# EAGLE design EMG - Module - Rev. B (EAGLE 9.6.2)

## Sheet 1 of 2
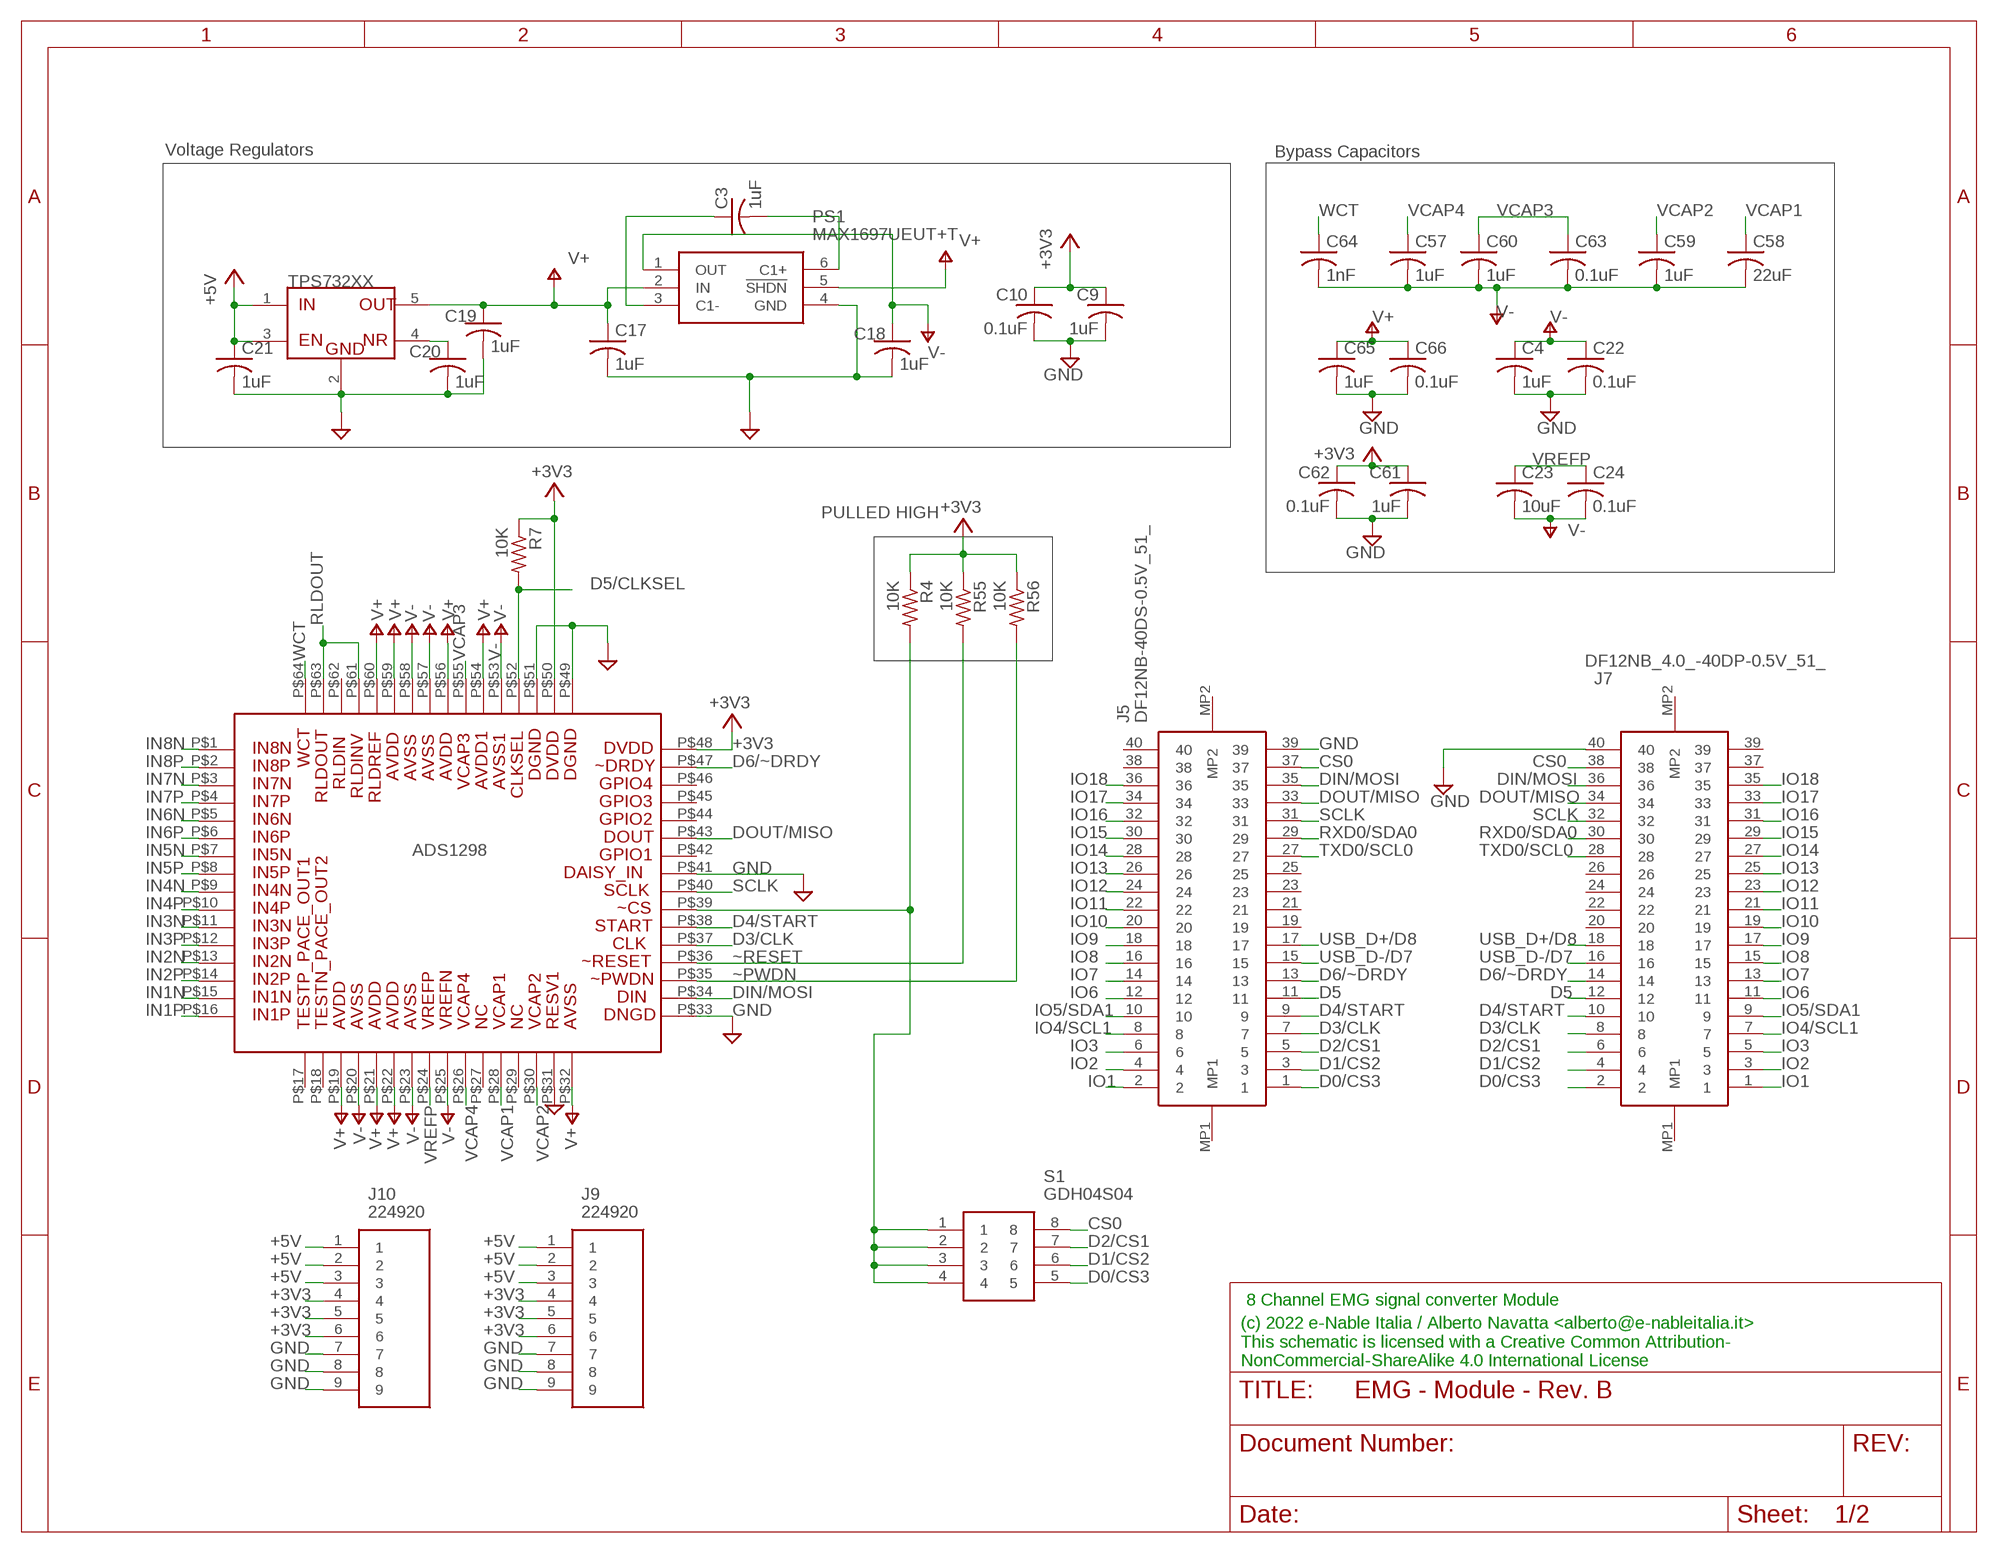
[diagram p0: schematic, sheet 1]

### Parts
C3  1uF  C-USC0402  [C0402]
C4  1uF  C-USC0402  [C0402]
C9  1uF  C-USC0402  [C0402]
C10  0.1uF  C-USC0402  [C0402]
C17  1uF  C-USC0402  [C0402]
C18  1uF  C-USC0402  [C0402]
C19  1uF  C-USC0402  [C0402]
C20  1uF  C-USC0402  [C0402]
C21  1uF  C-USC0402  [C0402]
C22  0.1uF  C-USC0402  [C0402]
C23  10uF  C-USC0402  [C0402]
C24  0.1uF  C-USC0402  [C0402]
C57  1uF  C-USC0402  [C0402]
C58  22uF  C-USC0402  [C0402]
C59  1uF  C-USC0402  [C0402]
C60  1uF  C-USC0402  [C0402]
C61  1uF  C-USC0402  [C0402]
C62  0.1uF  C-USC0402  [C0402]
C63  0.1uF  C-USC0402  [C0402]
C64  1nF  C-USC0402  [C0402]
C65  1uF  C-USC0402  [C0402]
C66  0.1uF  C-USC0402  [C0402]
J5  DF12NB-40DS-0.5V_51_  [DF12NB40DS05V51]
J7  DF12NB_4.0_-40DP-0.5V_51_  [DF12NB4040DP05V51]
J9  224920  [224920]
J10  224920  [224920]
PS1  MAX1697UEUT+T  [SOT95P280X145-6N]
R4  10K  R-US_R0402  [R0402]
R7  10K  R-US_R0402  [R0402]
R55  10K  R-US_R0402  [R0402]
R56  10K  R-US_R0402  [R0402]
S1  GDH04S04  [SOIC127P813X256-8N]
U1  U1  ADS1298  [TQFP-64]
U21  TPS732XX  [SOT23-5]

### Nets
+3V3: C9.1 C10.1 C61.1 C62.1 J9.4 J9.5 J9.6 J10.4 J10.5 J10.6 R4.1 R7.1 R55.1 R56.1 U1.P$48 U1.P$50
+5V: C21.1 J9.1 J9.2 J9.3 J10.1 J10.2 J10.3 U21.1(IN) U21.3(EN)
CS0: J5.37 J7.38 S1.8
D0/CS3: J5.1 J7.2 S1.5
D1/CS2: J5.3 J7.4 S1.6
D2/CS1: J5.5 J7.6 S1.7
D3/CLK: J5.7 J7.8 U1.P$37
D4/START: J5.9 J7.10 U1.P$38
D5: J5.11 J7.12
D5/CLKSEL: R7.2 U1.P$52
D6/~DRDY: J5.13 J7.14 U1.P$47
DIN/MOSI: J5.35 J7.36 U1.P$34
DOUT/MISO: J5.33 J7.34 U1.P$43
GND: C4.2 C9.2 C10.2 C17.2 C18.2 C19.2 C20.2 C21.2 C22.2 C61.2 C62.2 C65.2 C66.2 J5.39 J7.40 J9.7 J9.8 J9.9 J10.7 J10.8 J10.9 PS1.4(GND) U1.P$31 U1.P$33 U1.P$41 U1.P$49 U1.P$51 U21.2(GND) ; also sheet 2
IN1N: U1.P$15 ; also sheet 2
IN1P: U1.P$16 ; also sheet 2
IN2N: U1.P$13 ; also sheet 2
IN2P: U1.P$14 ; also sheet 2
IN3N: U1.P$11 ; also sheet 2
IN3P: U1.P$12 ; also sheet 2
IN4N: U1.P$9 ; also sheet 2
IN4P: U1.P$10 ; also sheet 2
IN5N: U1.P$7 ; also sheet 2
IN5P: U1.P$8 ; also sheet 2
IN6N: U1.P$5 ; also sheet 2
IN6P: U1.P$6 ; also sheet 2
IN7N: U1.P$3 ; also sheet 2
IN7P: U1.P$4 ; also sheet 2
IN8N: U1.P$1 ; also sheet 2
IN8P: U1.P$2 ; also sheet 2
IO1: J5.2 J7.1
IO2: J5.4 J7.3
IO3: J5.6 J7.5
IO4/SCL1: J5.8 J7.7
IO5/SDA1: J5.10 J7.9
IO6: J5.12 J7.11
IO7: J5.14 J7.13
IO8: J5.16 J7.15
IO9: J5.18 J7.17
IO10: J5.20 J7.19
IO11: J5.22 J7.21
IO12: J5.24 J7.23
IO13: J5.26 J7.25
IO14: J5.28 J7.27
IO15: J5.30 J7.29
IO16: J5.32 J7.31
IO17: J5.34 J7.33
IO18: J5.36 J7.35
N$17: C3.1 PS1.3(C1-)
N$18: C3.2 PS1.6(C1+)
N$20: C20.1 U21.4(NR)
RLDOUT: U1.P$61 U1.P$63 ; also sheet 2
RXD0/SDA0: J5.29 J7.30
SCLK: J5.31 J7.32 U1.P$40
TXD0/SCL0: J5.27 J7.28
USB_D+/D8: J5.17 J7.18
USB_D-/D7: J5.15 J7.16
V+: C17.1 C19.1 C65.1 C66.1 PS1.2(IN) PS1.5(!SHDN) U1.P$19 U1.P$21 U1.P$22 U1.P$32 U1.P$54 U1.P$56 U1.P$59 U1.P$60 U21.5(OUT)
V-: C4.1 C18.1 C22.1 C23.2 C24.2 C57.2 C58.2 C59.2 C60.2 C63.2 C64.2 PS1.1(OUT) U1.P$20 U1.P$23 U1.P$25 U1.P$53 U1.P$57 U1.P$58
VCAP1: C58.1 U1.P$28
VCAP2: C59.1 U1.P$30
VCAP3: C60.1 C63.1 U1.P$55
VCAP4: C57.1 U1.P$26
VREFP: C23.1 C24.1 U1.P$24
WCT: C64.1 U1.P$64
~CS: R4.2 S1.1 S1.2 S1.3 S1.4 U1.P$39
~PWDN: R56.2 U1.P$35
~RESET: R55.2 U1.P$36
Unconnected: J5.19 J5.21 J5.23 J5.25 J5.38 J5.40 J5.MP1 J5.MP2 J7.20 J7.22 J7.24 J7.26 J7.37 J7.39 J7.MP1 J7.MP2 U1.P$17 U1.P$18 U1.P$27 U1.P$29 U1.P$42 U1.P$44 U1.P$45 U1.P$46 U1.P$62

### Notes on the sheet
- Voltage Regulators | Bypass Capacitors
- PULLED HIGH
- 8 Channel EMG signal converter Module
- (c) 2022 e-Nable Italia / Alberto Navatta <alberto@e-nableitalia.it>
  This schematic is licensed with a Creative Common Attribution-
  NonCommercial-ShareAlike 4.0 International License

## Sheet 2 of 2
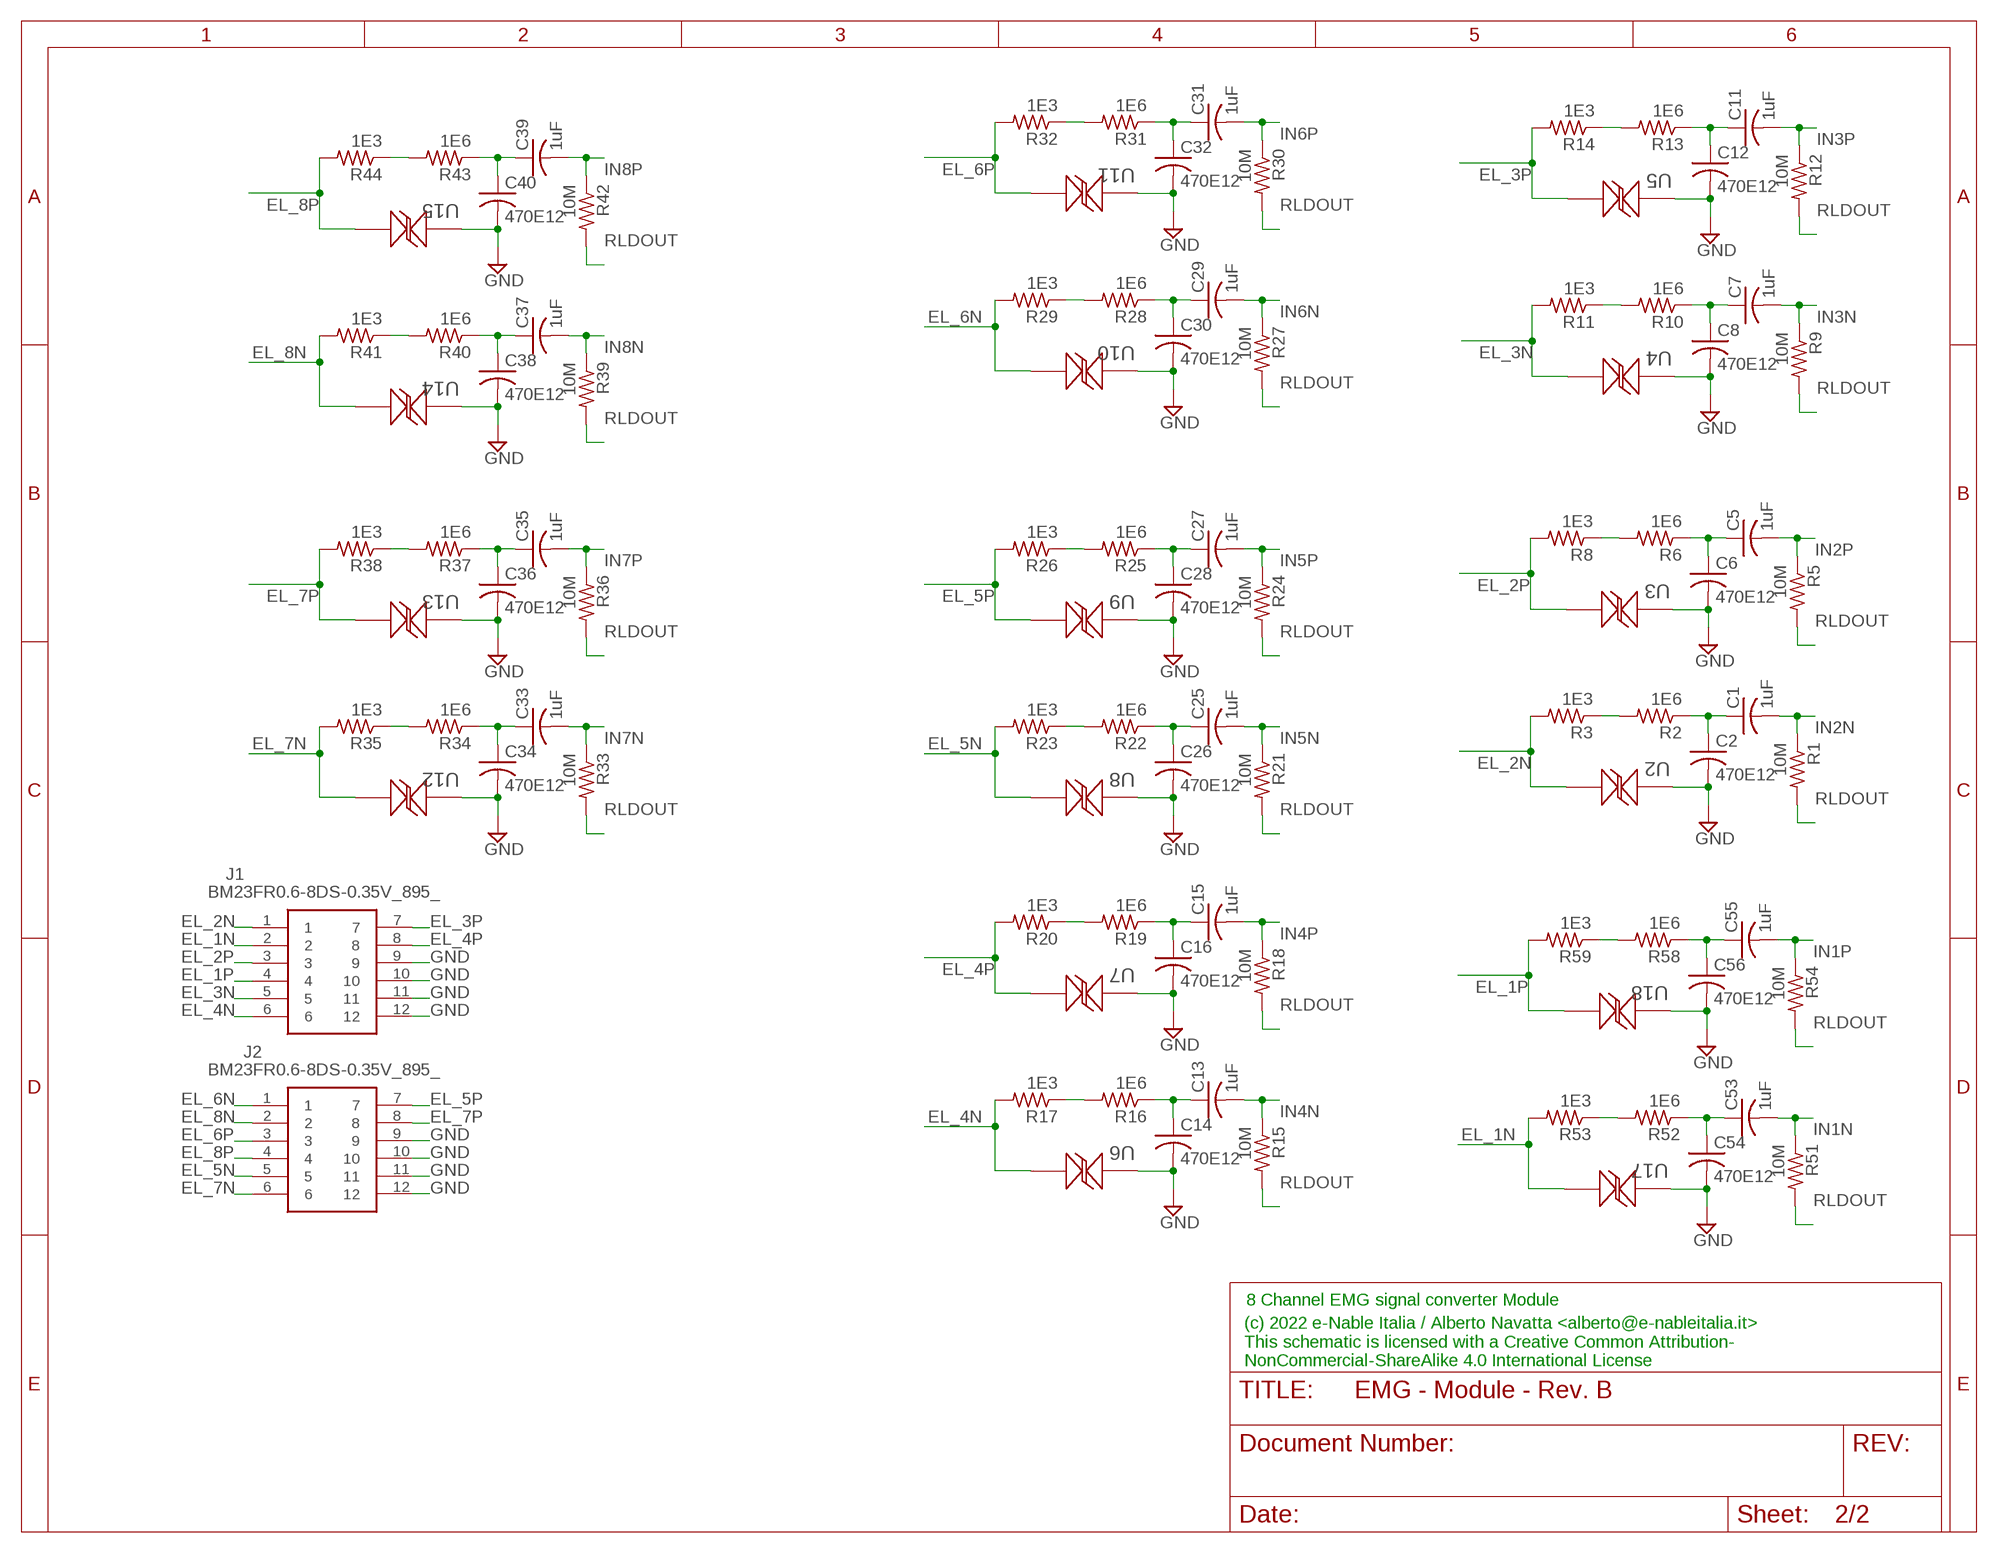
[diagram p1: schematic, sheet 2]

### Parts
C1  1uF  C-USC0402  [C0402]
C2  470E12  C-USC0402  [C0402]
C5  1uF  C-USC0402  [C0402]
C6  470E12  C-USC0402  [C0402]
C7  1uF  C-USC0402  [C0402]
C8  470E12  C-USC0402  [C0402]
C11  1uF  C-USC0402  [C0402]
C12  470E12  C-USC0402  [C0402]
C13  1uF  C-USC0402  [C0402]
C14  470E12  C-USC0402  [C0402]
C15  1uF  C-USC0402  [C0402]
C16  470E12  C-USC0402  [C0402]
C25  1uF  C-USC0402  [C0402]
C26  470E12  C-USC0402  [C0402]
C27  1uF  C-USC0402  [C0402]
C28  470E12  C-USC0402  [C0402]
C29  1uF  C-USC0402  [C0402]
C30  470E12  C-USC0402  [C0402]
C31  1uF  C-USC0402  [C0402]
C32  470E12  C-USC0402  [C0402]
C33  1uF  C-USC0402  [C0402]
C34  470E12  C-USC0402  [C0402]
C35  1uF  C-USC0402  [C0402]
C36  470E12  C-USC0402  [C0402]
C37  1uF  C-USC0402  [C0402]
C38  470E12  C-USC0402  [C0402]
C39  1uF  C-USC0402  [C0402]
C40  470E12  C-USC0402  [C0402]
C53  1uF  C-USC0402  [C0402]
C54  470E12  C-USC0402  [C0402]
C55  1uF  C-USC0402  [C0402]
C56  470E12  C-USC0402  [C0402]
J1  BM23FR0.6-8DS-0.35V_895_  [BM23FR068DS035V895]
J2  BM23FR0.6-8DS-0.35V_895_  [BM23FR068DS035V895]
R1  10M  R-US_R0402  [R0402]
R2  1E6  R-US_R0402  [R0402]
R3  1E3  R-US_R0402  [R0402]
R5  10M  R-US_R0402  [R0402]
R6  1E6  R-US_R0402  [R0402]
R8  1E3  R-US_R0402  [R0402]
R9  10M  R-US_R0402  [R0402]
R10  1E6  R-US_R0402  [R0402]
R11  1E3  R-US_R0402  [R0402]
R12  10M  R-US_R0402  [R0402]
R13  1E6  R-US_R0402  [R0402]
R14  1E3  R-US_R0402  [R0402]
R15  10M  R-US_R0402  [R0402]
R16  1E6  R-US_R0402  [R0402]
R17  1E3  R-US_R0402  [R0402]
R18  10M  R-US_R0402  [R0402]
R19  1E6  R-US_R0402  [R0402]
R20  1E3  R-US_R0402  [R0402]
R21  10M  R-US_R0402  [R0402]
R22  1E6  R-US_R0402  [R0402]
R23  1E3  R-US_R0402  [R0402]
R24  10M  R-US_R0402  [R0402]
R25  1E6  R-US_R0402  [R0402]
R26  1E3  R-US_R0402  [R0402]
R27  10M  R-US_R0402  [R0402]
R28  1E6  R-US_R0402  [R0402]
R29  1E3  R-US_R0402  [R0402]
R30  10M  R-US_R0402  [R0402]
R31  1E6  R-US_R0402  [R0402]
R32  1E3  R-US_R0402  [R0402]
R33  10M  R-US_R0402  [R0402]
R34  1E6  R-US_R0402  [R0402]
R35  1E3  R-US_R0402  [R0402]
R36  10M  R-US_R0402  [R0402]
R37  1E6  R-US_R0402  [R0402]
R38  1E3  R-US_R0402  [R0402]
R39  10M  R-US_R0402  [R0402]
R40  1E6  R-US_R0402  [R0402]
R41  1E3  R-US_R0402  [R0402]
R42  10M  R-US_R0402  [R0402]
R43  1E6  R-US_R0402  [R0402]
R44  1E3  R-US_R0402  [R0402]
R51  10M  R-US_R0402  [R0402]
R52  1E6  R-US_R0402  [R0402]
R53  1E3  R-US_R0402  [R0402]
R54  10M  R-US_R0402  [R0402]
R58  1E6  R-US_R0402  [R0402]
R59  1E3  R-US_R0402  [R0402]
U2  U2  ESD401DPYR  [DPY0002A]
U3  U3  ESD401DPYR  [DPY0002A]
U4  U4  ESD401DPYR  [DPY0002A]
U5  U5  ESD401DPYR  [DPY0002A]
U6  U6  ESD401DPYR  [DPY0002A]
U7  U7  ESD401DPYR  [DPY0002A]
U8  U8  ESD401DPYR  [DPY0002A]
U9  U9  ESD401DPYR  [DPY0002A]
U10  U10  ESD401DPYR  [DPY0002A]
U11  U18  ESD401DPYR  [DPY0002A]
U12  U12  ESD401DPYR  [DPY0002A]
U13  U13  ESD401DPYR  [DPY0002A]
U14  U14  ESD401DPYR  [DPY0002A]
U15  U15  ESD401DPYR  [DPY0002A]
U17  U17  ESD401DPYR  [DPY0002A]
U18  U18  ESD401DPYR  [DPY0002A]

### Nets
EL_1N: J1.2 R53.2 U17.2
EL_1P: J1.4 R59.2 U18.2
EL_2N: J1.1 R3.2 U2.2
EL_2P: J1.3 R8.2 U3.2
EL_3N: J1.5 R11.2 U4.2
EL_3P: J1.7 R14.2 U5.2
EL_4N: J1.6 R17.2 U6.2
EL_4P: J1.8 R20.2 U7.2
EL_5N: J2.5 R23.2 U8.2
EL_5P: J2.7 R26.2 U9.2
EL_6N: J2.1 R29.2 U10.2
EL_6P: J2.3 R32.2 U11.2
EL_7N: J2.6 R35.2 U12.2
EL_7P: J2.8 R38.2 U13.2
EL_8N: J2.2 R41.2 U14.2
EL_8P: J2.4 R44.2 U15.2
GND: C2.2 C6.2 C8.2 C12.2 C14.2 C16.2 C26.2 C28.2 C30.2 C32.2 C34.2 C36.2 C38.2 C40.2 C54.2 C56.2 J1.9 J1.10 J1.11 J1.12 J2.9 J2.10 J2.11 J2.12 U2.1 U3.1 U4.1 U5.1 U6.1 U7.1 U8.1 U9.1 U10.1 U11.1 U12.1 U13.1 U14.1 U15.1 U17.1 U18.1 ; also sheet 1
IN1N: C53.2 R51.1 ; also sheet 1
IN1P: C55.2 R54.1 ; also sheet 1
IN2N: C1.2 R1.1 ; also sheet 1
IN2P: C5.2 R5.1 ; also sheet 1
IN3N: C7.2 R9.1 ; also sheet 1
IN3P: C11.2 R12.1 ; also sheet 1
IN4N: C13.2 R15.1 ; also sheet 1
IN4P: C15.2 R18.1 ; also sheet 1
IN5N: C25.2 R21.1 ; also sheet 1
IN5P: C27.2 R24.1 ; also sheet 1
IN6N: C29.2 R27.1 ; also sheet 1
IN6P: C31.2 R30.1 ; also sheet 1
IN7N: C33.2 R33.1 ; also sheet 1
IN7P: C35.2 R36.1 ; also sheet 1
IN8N: C37.2 R39.1 ; also sheet 1
IN8P: C39.2 R42.1 ; also sheet 1
N$1: C1.1 C2.1 R2.1
N$2: R2.2 R3.1
N$3: C5.1 C6.1 R6.1
N$4: R6.2 R8.1
N$5: C7.1 C8.1 R10.1
N$6: R10.2 R11.1
N$7: C11.1 C12.1 R13.1
N$8: R13.2 R14.1
N$9: C13.1 C14.1 R16.1
N$10: R16.2 R17.1
N$11: C15.1 C16.1 R19.1
N$12: R19.2 R20.1
N$13: C25.1 C26.1 R22.1
N$14: R22.2 R23.1
N$15: C27.1 C28.1 R25.1
N$16: R25.2 R26.1
N$19: C29.1 C30.1 R28.1
N$21: R28.2 R29.1
N$22: C31.1 C32.1 R31.1
N$23: R31.2 R32.1
N$24: C33.1 C34.1 R34.1
N$25: R34.2 R35.1
N$26: C35.1 C36.1 R37.1
N$27: R37.2 R38.1
N$28: C37.1 C38.1 R40.1
N$29: R40.2 R41.1
N$30: C39.1 C40.1 R43.1
N$31: R43.2 R44.1
N$36: C53.1 C54.1 R52.1
N$37: R52.2 R53.1
N$38: C55.1 C56.1 R58.1
N$39: R58.2 R59.1
RLDOUT: R1.2 R5.2 R9.2 R12.2 R15.2 R18.2 R21.2 R24.2 R27.2 R30.2 R33.2 R36.2 R39.2 R42.2 R51.2 R54.2 ; also sheet 1

### Notes on the sheet
- 8 Channel EMG signal converter Module
- (c) 2022 e-Nable Italia / Alberto Navatta <alberto@e-nableitalia.it>
  This schematic is licensed with a Creative Common Attribution-
  NonCommercial-ShareAlike 4.0 International License

## Library data of the parts
C1 C2 C5-C8 C11-C16 C25-C40 C53-C56 = rcl:C-US: CAPACITOR, American symbol; SPICEPREFIX: C
C3 C4 C9 C10 C17-C24 C57-C66 = adafruit:C-US: CAPACITOR, American symbol
J1 J2 = SamacSys_Parts:BM23FR0.6-8DS-0.35V_895_: Board to Board & Mezzanine Connectors 8P RCPT STRGHT SMT SIGNAL ONLY Source: Datasheet <https://www.hirose.com/product/document?clcode=CL0480-0360-0-95&productname=BM23FR0.6-8DS-0.35V(895)&series=BM23FR&documenttype=2DDrawing&lang=en&documentid=D165611_en>; DESCRIPTION: Board to Board & Mezzanine Connectors 8P RCPT STRGHT SMT SIGNAL ONLY; HEIGHT: 0.6mm; MANUFACTURER_NAME: Hirose; MANUFACTURER_PART_NUMBER: BM23FR0.6-8DS-0.35V(895); MOUSER_PART_NUMBER: 798-23FR068DS035V895; MOUSER_PRICE-STOCK: https://www.mouser.co.uk/ProductDetail/Hirose-Connector/BM23FR0.6-8DS-0.35V895?qs=YCa%2FAAYMW02DW55bS3fRtQ%3D%3D
J5 = SamacSys_Parts:DF12NB-40DS-0.5V_51_: Board to Board & Mezzanine Connectors CONN RCPT 36POS SMD Source: Datasheet <https://www.hirose.com/en/product/document?clcode=CL0537-0290-0-51&productname=DF12NB-40DS-0.5V(51)&series=DF12N&documenttype=2DDrawing&lang=en&documentid=0001367362>; DESCRIPTION: Board to Board & Mezzanine Connectors CONN RCPT 36POS SMD; HEIGHT: 2.9mm; MANUFACTURER_NAME: Hirose; MANUFACTURER_PART_NUMBER: DF12NB-40DS-0.5V(51); MOUSER_PART_NUMBER: 798-DF12NB40DS0551; MOUSER_PRICE-STOCK: https://www.mouser.co.uk/ProductDetail/Hirose-Connector/DF12NB-40DS-0.5V51?qs=DPoM0jnrROV9WbEBnogTmg%3D%3D
J7 = SamacSys_Parts:DF12NB_4.0_-40DP-0.5V_51_: Board to!! Board !! & Mezzanine Connectors CONN HDR 40POS SMD G Source: Datasheet <https://www.hirose.com/en/product/document?clcode=CL0537-0596-0-51&productname=DF12NB(4.0)-40DP-0.5V(51)&series=DF12N&documenttype=2DDrawing&lang=en&documentid=0001367371>; DESCRIPTION: Board to!! Board !! & Mezzanine Connectors CONN HDR 40POS SMD G; HEIGHT: 3.5mm; MANUFACTURER_NAME: Hirose; MANUFACTURER_PART_NUMBER: DF12NB(4.0)-40DP-0.5V(51); MOUSER_PART_NUMBER: 798-DF12NB4040DP0551; MOUSER_PRICE-STOCK: https://www.mouser.co.uk/ProductDetail/Hirose-Connector/DF12NB4.0-40DP-0.5V51?qs=DPoM0jnrROUKZpllIjGjYw%3D%3D
J9 J10 = SamacSys_Parts:224920: Board to Board & Mezzanine Connectors 9P 0.8MM VERT FML CLASS 4 3MM SMT Source: Datasheet; DESCRIPTION: Board to Board & Mezzanine Connectors 9P 0.8MM VERT FML CLASS 4 3MM SMT; HEIGHT: 3.96mm; MANUFACTURER_NAME: ERNI; MANUFACTURER_PART_NUMBER: 224920; MOUSER_PART_NUMBER: 305-224920; MOUSER_PRICE-STOCK: https://www.mouser.co.uk/ProductDetail/ERNI/224920?qs=Kh9WxvXxjWmfiTh6L%2FvUxg%3D%3D
PS1 = SamacSys_Parts:MAX1697UEUT+T: MAXIM INTEGRATED PRODUCTS - MAX1697UEUT+T - CHARGE PUMP, INVERTING, SOT-23-6 Source: Datasheet <https://componentsearchengine.com/Datasheets/2/MAX1697UEUT T.pdf>; DESCRIPTION: MAXIM INTEGRATED PRODUCTS - MAX1697UEUT+T - CHARGE PUMP, INVERTING, SOT-23-6; HEIGHT: 1.45mm; MANUFACTURER_NAME: Maxim Integrated; MANUFACTURER_PART_NUMBER: MAX1697UEUT+T; MOUSER_PART_NUMBER: 700-MAX1697UEUT+T; MOUSER_PRICE-STOCK: https://www.mouser.co.uk/ProductDetail/Maxim-Integrated/MAX1697UEUT%2bT?qs=tN2KIZ2dHC5YEnQi4QVGng%3D%3D
R1-R3 R5 R6 R8-R44 R51-R54 R58 R59 = rcl:R-US_: RESISTOR, American symbol; SPICEPREFIX: R
R4 R7 R55 R56 = adafruit:R-US_: RESISTOR, American symbol
S1 = SamacSys_Parts:GDH04S04: 4way half pitch surface mount DIL switch 4 Way Surface Mount DIP Switch 4P Source: Datasheet <http://www.te.com/commerce/DocumentDelivery/DDEController?Action=showdoc&DocId=Customer Drawing1571983C6pdfEnglishENG_CD_1571983_C6.pdf1571983-4>; DESCRIPTION: 4way half pitch surface mount DIL switch 4 Way Surface Mount DIP Switch 4P; HEIGHT: 2.56mm; MANUFACTURER_NAME: TE Connectivity; MANUFACTURER_PART_NUMBER: GDH04S04; MOUSER_PART_NUMBER: 506-GDH04S04; MOUSER_PRICE-STOCK: https://www.mouser.co.uk/ProductDetail/TE-Connectivity-Alcoswitch/GDH04S04?qs=wg6chLqwgwrFTPnUQOwjIg%3D%3D
U1 = ADS1298:ADS1298: ADS1298 Chris Yim - May 2015
U2-U15 U17 U18 = ESD401:ESD401DPYR; COPYRIGHT: Copyright (C) 2022 Ultra Librarian. All rights reserved.; MANUFACTURER_PART_NUMBER: ESD401DPYR; MFR_NAME: Texas Instruments; REFDES: RefDes; TYPE: TYPE
U21 = sot23-5:TPS732XX

## Module ELECTRODE
Ports: 

### Library data of the parts

## Net classes
2 Power: width 0.203 mm

## Board
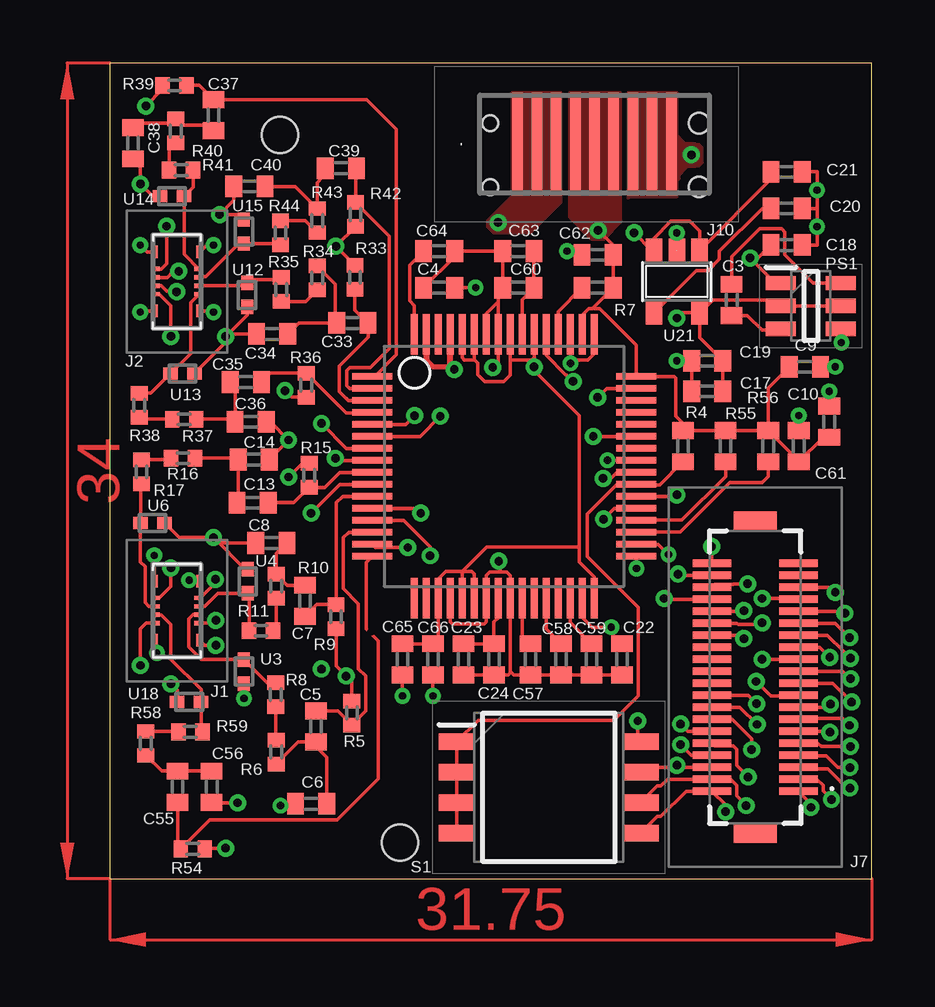
[diagram p2: board, top side]
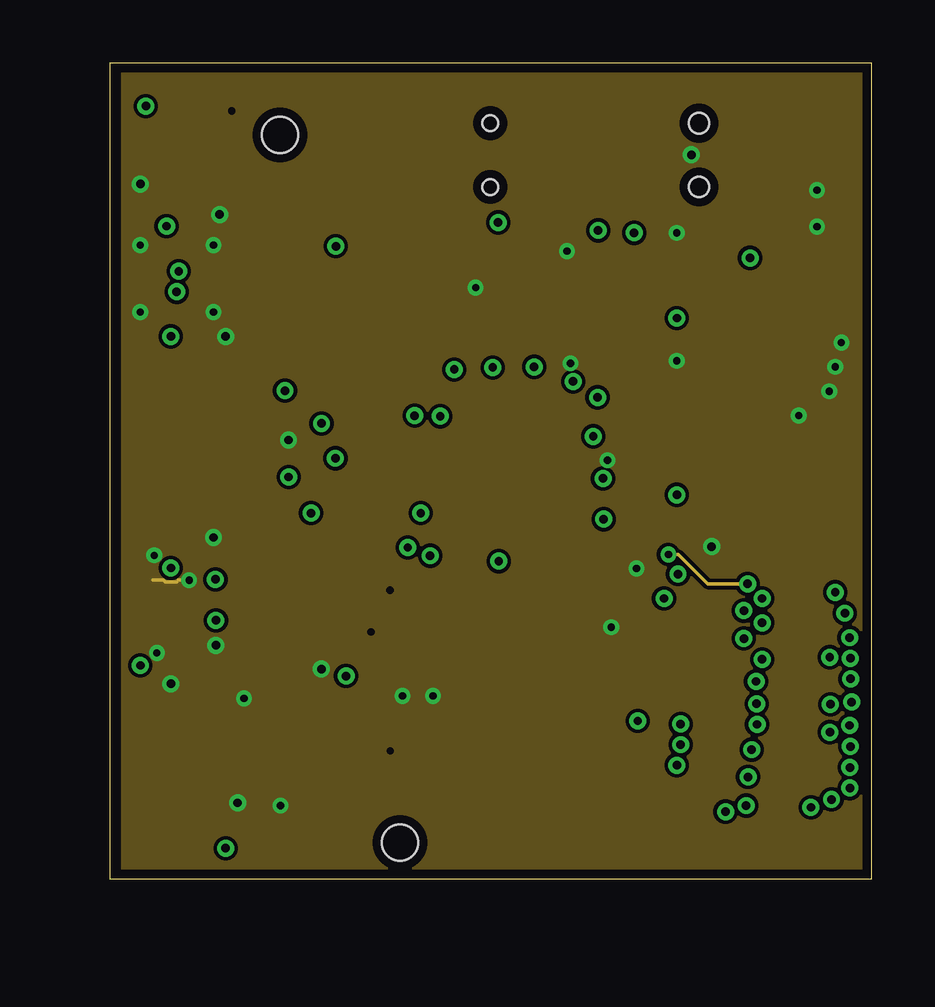
[diagram p3: board, inner layer Route2]
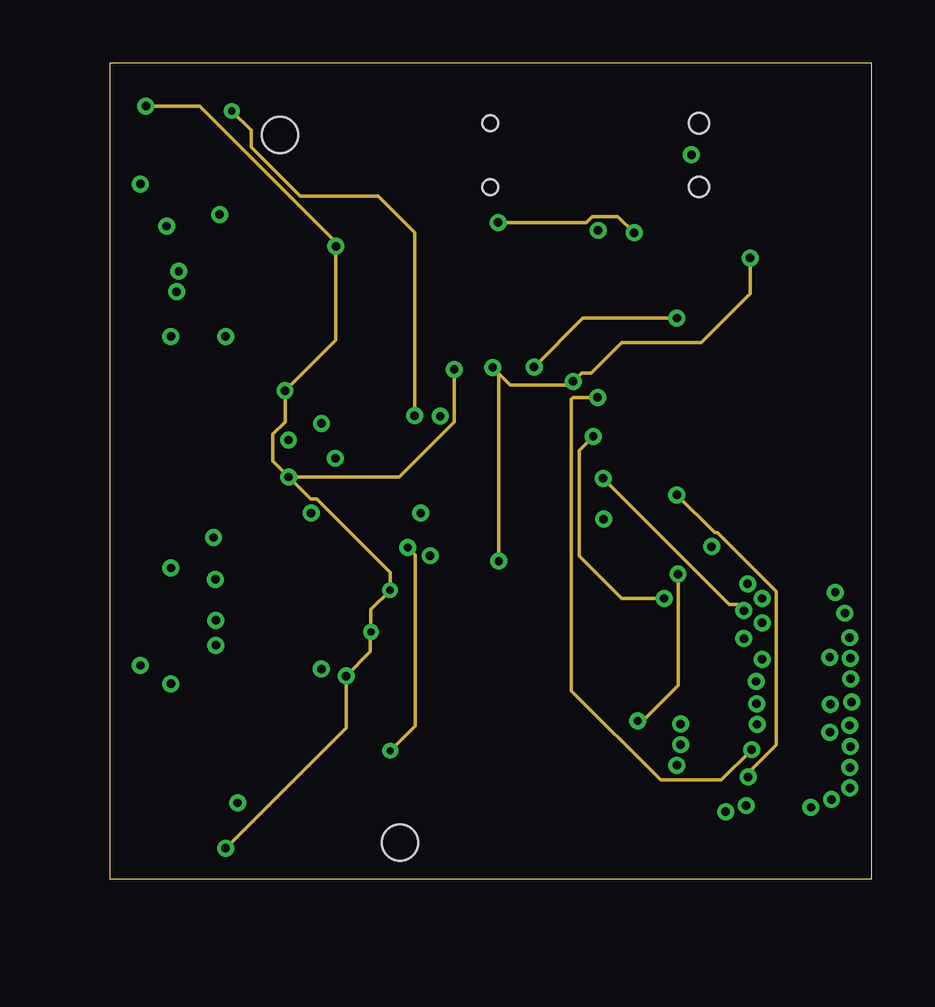
[diagram p4: board, inner layer Route15]
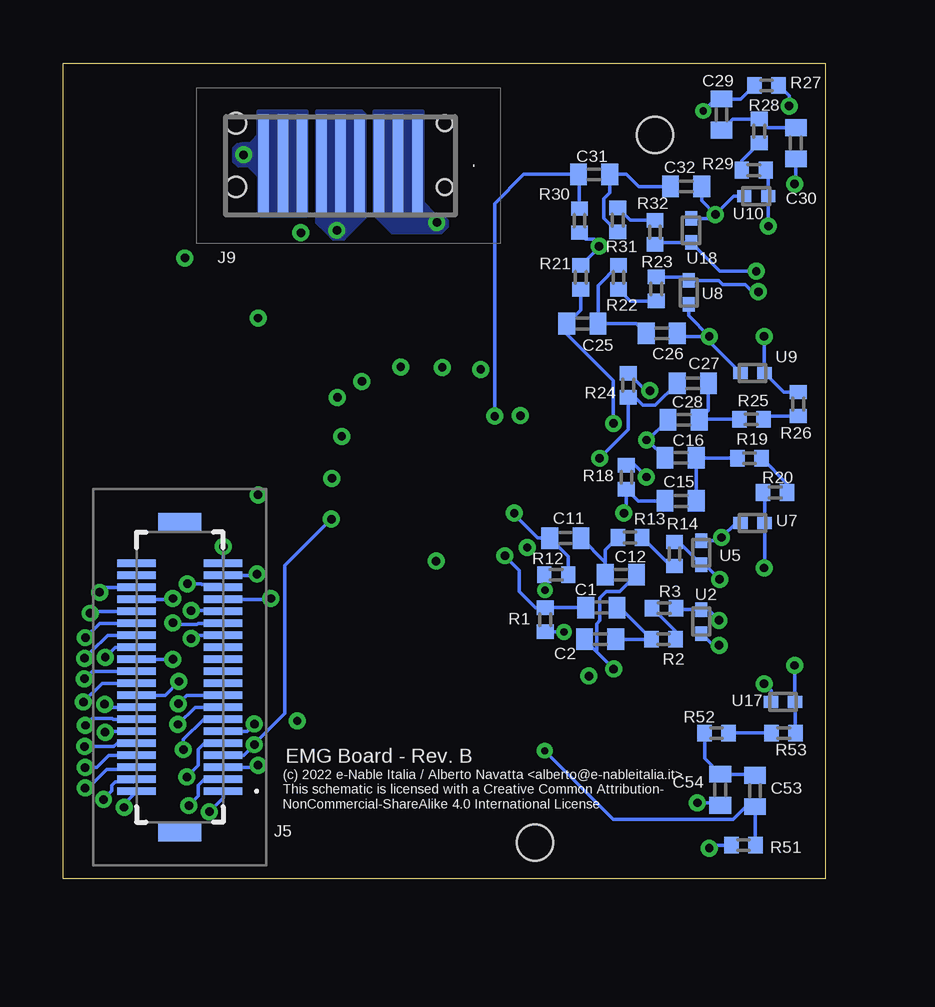
[diagram p5: board, bottom side, seen from below]

Size 31.75 x 34 mm. Coordinates in mm from the lower left corner, seen from the top.
Outline: 0,0 31.75,0 31.75,34 0,34 0,0
Copper layers ([2:1+(2*15)+16:15]): Top 0.0356mm / dielectric 1.5011mm / Route2 0.0356mm / dielectric 0.1499mm / Route15 0.0356mm / dielectric 0.2007mm / Bottom 0.0356mm
Design rules "LaenPCBOrder *": minimum track width 6mil, minimum drill 0.35mm, track to track 6mil, track to pad 6mil, pad to pad 6mil, via to via 6mil, smd to smd 6mil, copper to edge 15mil, drill to drill 6mil, minimum pad ring 7mil, minimum via ring 7mil, stop-mask expansion 3mil, vias tented up to drill 14mil, thermal gap 10mil
Holes 1.5 mm at 12.09,1.5 7.09,31

### Footprints (pad centres in the part's own frame; a part is rotated, then mirrored left to right if it is on the bottom)
C0402 = smd 0.7 x 0.9: 1 -0.65,0; 2 0.65,0
BM23FR068DS035V895 = smd 0.18 x 0.38: 1 -0.525,-0.91; 2 -0.525,0.91; 3 -0.175,-0.91; 4 -0.175,0.91; 5 0.175,-0.91; 6 0.175,0.91; 7 0.525,-0.91; 8 0.525,0.91 | smd 0.52 x 0.3: 9 -1.23,-0.95; 10 -1.23,0.95; 11 1.23,-0.95; 12 1.23,0.95
DF12NB40DS05V51 = smd 0.3 x 1.6: 1 -4.75,-1.8; 2 -4.75,1.8; 3 -4.25,-1.8; 4 -4.25,1.8; 5 -3.75,-1.8; 6 -3.75,1.8; 7 -3.25,-1.8; 8 -3.25,1.8; 9 -2.75,-1.8; 10 -2.75,1.8; 11 -2.25,-1.8; 12 -2.25,1.8; 13 -1.75,-1.8; 14 -1.75,1.8; 15 -1.25,-1.8; 16 -1.25,1.8; 17 -0.75,-1.8; 18 -0.75,1.8; 19 -0.25,-1.8; 20 -0.25,1.8; 21 0.25,-1.8; 22 0.25,1.8; 23 0.75,-1.8; 24 0.75,1.8; 25 1.25,-1.8; 26 1.25,1.8; 27 1.75,-1.8; 28 1.75,1.8; 29 2.25,-1.8; 30 2.25,1.8; 31 2.75,-1.8; 32 2.75,1.8; 33 3.25,-1.8; 34 3.25,1.8; 35 3.75,-1.8; 36 3.75,1.8; 37 4.25,-1.8; 38 4.25,1.8; 39 4.75,-1.8; 40 4.75,1.8 | smd 0.8 x 1.8: MP1 -6.45,0; MP2 6.45,0
DF12NB4040DP05V51 = smd 0.3 x 1.6: 1 -4.75,-1.8; 2 -4.75,1.8; 3 -4.25,-1.8; 4 -4.25,1.8; 5 -3.75,-1.8; 6 -3.75,1.8; 7 -3.25,-1.8; 8 -3.25,1.8; 9 -2.75,-1.8; 10 -2.75,1.8; 11 -2.25,-1.8; 12 -2.25,1.8; 13 -1.75,-1.8; 14 -1.75,1.8; 15 -1.25,-1.8; 16 -1.25,1.8; 17 -0.75,-1.8; 18 -0.75,1.8; 19 -0.25,-1.8; 20 -0.25,1.8; 21 0.25,-1.8; 22 0.25,1.8; 23 0.75,-1.8; 24 0.75,1.8; 25 1.25,-1.8; 26 1.25,1.8; 27 1.75,-1.8; 28 1.75,1.8; 29 2.25,-1.8; 30 2.25,1.8; 31 2.75,-1.8; 32 2.75,1.8; 33 3.25,-1.8; 34 3.25,1.8; 35 3.75,-1.8; 36 3.75,1.8; 37 4.25,-1.8; 38 4.25,1.8; 39 4.75,-1.8; 40 4.75,1.8 | smd 0.8 x 1.8: MP1 -6.5,0; MP2 6.5,0
224920 = smd 0.44 x 4.3: 1 -3.2,0; 2 -2.4,0; 3 -1.6,0; 4 -0.8,0; 5 0,0; 6 0.8,0; 7 1.6,0; 8 2.4,0; 9 3.2,0 | hole 0.65: -4.35,0.88 | hole 0.85: 4.35,0.88
SOT95P280X145-6N = smd 1.25 x 0.6: 1 -1.25,0.95; 2 -1.25,0; 3 -1.25,-0.95; 4 1.25,-0.95; 5 1.25,0; 6 1.25,0.95
R0402 = smd 0.6 x 0.7: 1 -0.5,0; 2 0.5,0
R0402' = smd 0.7 x 0.9: 1 -0.65,0; 2 0.65,0
SOIC127P813X256-8N = smd 1.475 x 0.7: 1 -3.838,1.905; 2 -3.838,0.635; 3 -3.838,-0.635; 4 -3.838,-1.905; 5 3.838,-1.905; 6 3.838,-0.635; 7 3.838,0.635; 8 3.838,1.905
TQFP-64 = smd 1.676 x 0.279: P$1 -5.58,3.67; P$2 -5.58,3.17; P$3 -5.58,2.67; P$4 -5.58,2.17; P$5 -5.58,1.67; P$6 -5.58,1.17; P$7 -5.58,0.67; P$8 -5.58,0.17; P$9 -5.58,-0.33; P$10 -5.58,-0.83; P$11 -5.58,-1.33; P$12 -5.58,-1.83; P$13 -5.58,-2.33; P$14 -5.58,-2.83; P$15 -5.58,-3.33; P$16 -5.58,-3.83; P$33 5.42,-3.83; P$34 5.42,-3.33; P$35 5.42,-2.83; P$36 5.42,-2.33; P$37 5.42,-1.83; P$38 5.42,-1.33; P$39 5.42,-0.83; P$40 5.42,-0.33; P$41 5.42,0.17; P$42 5.42,0.67; P$43 5.42,1.17; P$44 5.42,1.67; P$45 5.42,2.17; P$46 5.42,2.67; P$47 5.42,3.17; P$48 5.42,3.67 | smd 0.279 x 1.676: P$17 -3.83,-5.58; P$18 -3.33,-5.58; P$19 -2.83,-5.58; P$20 -2.33,-5.58; P$21 -1.83,-5.58; P$22 -1.33,-5.58; P$23 -0.83,-5.58; P$24 -0.33,-5.58; P$25 0.17,-5.58; P$26 0.67,-5.58; P$27 1.17,-5.58; P$28 1.67,-5.58; P$29 2.17,-5.58; P$30 2.67,-5.58; P$31 3.17,-5.58; P$32 3.67,-5.58; P$49 3.67,5.42; P$50 3.17,5.42; P$51 2.67,5.42; P$52 2.17,5.42; P$53 1.67,5.42; P$54 1.17,5.42; P$55 0.67,5.42; P$56 0.17,5.42; P$57 -0.33,5.42; P$58 -0.83,5.42; P$59 -1.33,5.42; P$60 -1.83,5.42; P$61 -2.33,5.42; P$62 -2.83,5.42; P$63 -3.33,5.42; P$64 -3.83,5.42
DPY0002A = smd 0.6 x 0.5: 1 -0.5,0; 2 0.5,0
SOT23-5 = smd 0.69 x 0.99: 1 -0.95,-1.29; 2 0,-1.29; 3 0.95,-1.29; 4 0.95,1.3; 5 -0.95,1.3

### Placement (x,y rotation side)
C1  9.32,11.3 180 bottom
C2  9.37,9.98 180 bottom
C3  25.91,24.13 90 top
C4  13.72,24.64 0 top
C5  8.59,6.35 90 top
C6  8.38,3.12 180 top
C7  8.13,11.58 270 top
C8  6.73,14 180 top
C9  28.96,21.34 0 top
C10  29.97,19.05 90 top
C11  10.82,14.2 180 bottom
C12  8.51,12.67 0 bottom
C13  5.94,15.67 0 top
C14  5.99,17.48 0 top
C15  6.02,15.75 180 bottom
C16  6.02,17.55 180 bottom
C17  24.89,20.32 180 top
C18  28.19,26.42 0 top
C19  24.89,21.59 180 top
C20  28.19,27.94 0 top
C21  28.19,29.46 0 top
C22  21.34,9.14 90 top
C23  14.73,9.14 270 top
C24  16,9.14 270 top
C25  10.11,23.14 180 bottom
C26  6.81,22.73 0 bottom
C27  5.51,20.65 180 bottom
C28  5.89,19.13 180 bottom
C29  4.32,31.85 90 bottom
C30  1.22,30.66 270 bottom
C31  9.63,29.36 180 bottom
C32  5.79,28.85 0 bottom
C33  10.11,23.16 0 top
C34  6.76,22.71 180 top
C35  5.66,20.7 0 top
C36  5.87,19.05 0 top
C37  4.32,31.83 90 top
C38  0.97,30.66 270 top
C39  9.63,29.62 0 top
C40  5.82,28.85 180 top
C53  2.92,3.66 270 bottom
C54  4.37,3.71 270 bottom
C55  2.82,3.84 270 top
C56  4.24,3.84 270 top
C57  17.53,9.14 270 top
C58  18.8,9.14 270 top
C59  20.07,9.14 270 top
C60  17.02,24.64 180 top
C61  28.7,18.03 90 top
C62  20.32,26.01 180 top
C63  17.02,26.16 180 top
C64  13.72,26.16 0 top
C65  12.19,9.14 270 top
C66  13.46,9.14 270 top
J1  2.79,11.18 90 top
J2  2.79,24.89 270 top
J5  26.89,8.4 90 bottom
J7  26.89,8.4 90 top
J9  20.19,29.72 180 bottom
J10  20.19,30.62 0 top
PS1  29.21,23.88 0 top
R1  11.66,10.79 270 bottom
R2  6.73,9.98 0 bottom
R3  6.71,11.28 0 bottom
R4  10K  [R0402']  23.88,18.03 270 top
R5  10.08,6.91 90 top
R6  6.93,5.28 90 top
R7  10K  [R0402']  20.32,24.64 180 top
R8  6.91,7.67 90 top
R9  9.42,10.92 270 top
R10  6.93,12.19 270 top
R11  6.3,10.34 180 top
R12  11.2,12.67 180 bottom
R13  8.13,14.22 0 bottom
R14  6.27,13.54 90 bottom
R15  8.31,16.81 90 top
R16  3.05,17.53 180 top
R17  1.32,16.97 270 top
R18  8.28,16.74 90 bottom
R19  3.15,17.53 0 bottom
R20  2.08,16.1 180 bottom
R21  10.19,25.07 90 bottom
R22  8.61,25.07 270 bottom
R23  7.04,24.59 90 bottom
R24  8.2,20.57 90 bottom
R25  3.07,19.15 0 bottom
R26  1.12,19.79 90 bottom
R27  2.44,33.07 0 bottom
R28  2.74,31.17 270 bottom
R29  2.97,29.54 0 bottom
R30  10.24,27.43 270 bottom
R31  8.64,27.46 90 bottom
R32  7.09,26.95 270 bottom
R33  10.21,25.07 90 top
R34  8.64,25.04 270 top
R35  7.14,24.56 90 top
R36  8.18,20.57 270 top
R37  3.1,19.15 180 top
R38  1.22,19.74 90 top
R39  2.69,33.07 180 top
R40  2.74,31.17 270 top
R41  2.97,29.54 0 top
R42  10.24,27.69 270 top
R43  8.64,27.43 270 top
R44  7.11,26.92 270 top
R51  3.4,1.4 180 bottom
R52  4.52,6.07 0 bottom
R53  1.73,6.07 0 bottom
R54  3.45,1.24 0 top
R55  10K  [R0402']  25.65,18.03 270 top
R56  10K  [R0402']  27.43,18.03 270 top
R58  1.5,5.64 90 top
R59  3.35,6.12 0 top
S1  18.29,3.81 0 top
U1  16.51,17.27 0 top
U2  5.16,10.72 90 bottom
U3  5.59,8.64 90 top
U4  5.74,12.4 270 top
U5  5.16,13.59 270 bottom
U6  1.78,14.83 180 top
U7  3.02,14.83 0 bottom
U8  5.69,24.43 90 bottom
U9  3.02,21.08 0 bottom
U10  2.87,28.45 0 bottom
U11  5.59,27.03 270 bottom
U12  5.71,24.33 90 top
U13  3.02,21.06 180 top
U14  2.59,28.45 0 top
U15  5.59,26.97 270 top
U17  1.75,7.37 0 bottom
U18  3.3,7.37 0 top
U21  23.62,24.89 180 top

### Tracks (layer width: path | path; a pad name or v marks a point on that pad's centre or on a via)
+3V3  (via drill 0.35)
  Top 0.152: 20.14,23.8 20.09,23.76 19.95,23.76 19.68,23.49 U1.P$50 | 20.14,23.8 R7.1 | 20.14,23.8 20.18,23.76 20.41,23.76 21.93,22.24 U1.P$48 23.52,20.94 23.58,20.88 23.58,19.29 23.88,19 R4.1 R55.1 R56.1 | R56.1 28.7,17.41 C61.1 29.72,18.4 C10.1 | R56.1 27.43,20.46 C9.1 | R7.1 20.97,24.78 | v20.34,27.03 20.97,26.4 C62.1 21.08,26.01 20.97,25.9 R7.1
  Route2 0.152: 20.37,27 v20.34,27.03
  pour Bottom (no thermals): 19.3,32 21.18,32 21.18,27.36 20.75,26.92 20.5,26.67 20.32,26.67 20.07,26.67 19.96,26.77 19.18,27.56 19.18,27.64 19.18,31.88
  pour Top (no thermals): 19.15,32.77 21.26,32.77 21.26,27.46 21.31,27.41 20.57,26.67 20.07,26.67 19.15,27.58
+5V  (via drill 0.35)
  Top 0.152: C21.1 27.54,29.15 U21.1 24.57,26.99 24.16,27.41 23.37,27.41 22.67,26.71 U21.3 22.59,26.18 v21.84,26.92
  Route15 0.152: v16.18,27.36 19.85,27.36 20.11,27.61 21.16,27.61 v21.84,26.92
  pour Bottom (no thermals): 16.26,27.69 16,27.69 15.75,27.43 15.75,27.18 16,26.92 18.03,26.92 18.8,27.69 18.8,32 16.76,32 16.76,28.19
  pour Top (no thermals): 16.76,32.77 18.8,32.77 18.8,28.19 17.53,26.92 16,26.92 15.75,27.18 15.75,27.43 16.76,28.45
CS0  (via drill 0.35)
  Top 0.152: v23.67,12.7 23.72,12.65 J5.37 | S1.8 22,5.84 v22,6.58
  Route15 0.152: v22,6.58 22.2,6.58 23.67,8.05 v23.67,12.7
  Bottom 0.152: J5.37 23.72,12.65 v23.67,12.7
D0/CS3  (via drill 0.35)
  Top 0.152: S1.5 22.82,2.6 22.96,2.6 24.01,3.65 J5.1 25.65,3.08 v25.65,2.79
  Bottom 0.152: v25.65,2.79 25.09,3.36 J5.1
D1/CS2  (via drill 0.35)
  Top 0.152: S1.6 22.82,3.87 22.96,3.87 23.24,4.15 J5.3 25.86,4.15 26.12,3.9 26.12,3.44 v26.51,3.05
  Bottom 0.152: v26.51,3.05 26.12,3.44 26.12,3.9 25.86,4.15 J5.3
D2/CS1  (via drill 0.35)
  Top 0.152: S1.7 22.33,4.65 23.62,4.65 | 23.62,4.65 J5.5 | 23.62,4.65 v23.62,4.73
  Bottom 0.152: v23.62,4.73 23.7,4.65 J5.5
D3/CLK  (via drill 0.35)
  Top 0.152: v23.78,5.59 24.22,5.15 J5.7 | U1.P$37 21.02,15.44 v20.57,14.99
  Bottom 0.152: J5.7 24.22,5.15 v23.78,5.59 23.78,5.62 22.51,6.9 22.51,13.05 v20.57,14.99
D4/START  (via drill 0.35)
  Top 0.152: J5.9 25.21,5.53 25.98,5.53 26.12,5.39 26.12,4.72 v26.59,4.24 | v23.62,16 23.56,15.94 U1.P$38
  Route15 0.152: v23.62,16 25.2,14.42 25.31,14.42 27.76,11.98 27.76,5.58 26.59,4.41 v26.59,4.24
  Bottom 0.152: v26.59,4.24 26.12,4.72 26.12,5.39 25.86,5.65 J5.9
D5  (via drill 0.35)
  Top 0.152: v23.78,6.45 24.08,6.15 J5.11
  Bottom 0.152: J5.11 24.08,6.15 v23.78,6.45
D5/CLKSEL
  Top 0.152: U1.P$52 18.68,23.65 R7.2
D6/~DRDY  (via drill 0.35)
  Top 0.152: v26.74,5.38 26.74,5.84 25.93,6.65 J5.13 | v20.32,20.07 20.7,20.44 U1.P$47
  Route15 0.152: v26.74,5.38 25.47,4.11 22.95,4.11 19.23,7.83 19.23,19.99 19.3,20.07 v20.32,20.07
  Bottom 0.152: v26.74,5.38 26.74,5.81 25.9,6.65 J5.13
DIN/MOSI  (via drill 0.3 layers 1-2, 0.35)
  Top 0.152: J5.35 25.21,12.27 25.98,12.27 26,12.29 v26.57,12.29 | U1.P$34 22.85,13.94 v23.27,13.51
  Route2 0.152: v23.27,13.51 23.68,13.51 24.9,12.29 v26.57,12.29
  Bottom 0.152: J5.35 25.21,12.27 25.98,12.27 26,12.29 v26.57,12.29
DOUT/MISO  (via drill 0.35)
  Top 0.152: J5.33 23.12,11.65 v23.09,11.68 | v20.14,18.44 U1.P$43
  Route15 0.152: v23.09,11.68 21.34,11.68 19.56,13.46 19.56,17.86 v20.14,18.44
  Bottom 0.152: J5.33 23.12,11.65 v23.09,11.68
EL_1N  (via drill 0.35)
  Top 0.152: J1.2 1.51,10.65 1.27,10.41 v1.27,8.89
  Bottom 0.152: v1.27,8.89 1.27,7.38 U17.2 1.25,6.1 R53.2
EL_1P
  Top 0.152: R59.2 3.8,6.17 U18.2 3.8,7.88 2.54,9.14 2.54,10.6 2.14,10.99 J1.4
EL_2N  (via drill 0.35)
  Top 0.152: J1.1 4.31,10.66 v4.42,10.77
  Bottom 0.152: R3.2 6.21,11.22 U2.2 4.87,11.22 v4.42,10.77
EL_2P
  Top 0.152: R8.2 6.55,8.17 U3.2 3.82,9.14 3.81,9.14 3.81,9.15 3.29,9.67 3.29,10.84 3.47,11.02 3.69,11.02 J1.3
EL_3N
  Top 0.152: J1.5 3.96,11.36 4.5,11.89 U4.2 5.8,11.84 R11.2
EL_3P  (via drill 0.35)
  Top 0.152: J1.7 3.77,11.7 4.4,12.33 v4.4,12.48
  Bottom 0.152: v4.4,12.48 5.01,13.09 U5.2 6.11,14.04 R14.2
EL_4N
  Top 0.152: J1.6 1.62,11.36 1.46,11.52 1.46,13.01 1.27,13.21 U6.2 1.28,16.42 R17.2
EL_4P  (via drill 0.35)
  Top 0.152: J1.8 2.05,11.7 2.54,12.19 v2.54,12.95
  Bottom 0.152: v2.54,12.95 2.52,12.97 U7.2 2.52,16.04 R20.2
EL_5N  (via drill 0.35)
  Top 0.152: J2.5 2.15,24.72 2.37,24.49 2.76,24.49 v2.78,24.47
  Bottom 0.152: v2.78,24.47 3.04,24.47 3.34,24.77 4.26,24.77 4.43,24.93 U8.2 5.84,25.09 R23.2
EL_5P  (via drill 0.35)
  Top 0.152: J2.7 2.06,24.37 2.54,23.89 v2.54,22.61
  Bottom 0.152: v2.54,22.61 2.54,21.1 U9.2 1.73,20.29 R26.2
EL_6N  (via drill 0.35)
  Top 0.152: J2.1 2.14,25.42 2.36,25.64 v2.36,27.2
  Bottom 0.152: 2.47,29.32 2.47,29.46 | 2.47,29.46 R29.2 | v2.36,27.2 U10.2 2.37,29.36 2.47,29.46
EL_6P  (via drill 0.35)
  Top 0.152: J2.3 2.39,25.07 2.65,25.32 v2.87,25.32
  Bottom 0.152: v2.87,25.32 4.39,25.32 U11.2 7.01,26.53 R32.2
EL_7N
  Top 0.152: 6.91,24.83 7.04,24.96 | 7.04,24.96 R35.2 | J2.6 5.6,24.72 U12.2 5.85,24.96 7.04,24.96
EL_7P
  Top 0.152: J2.8 3.7,24.36 3.37,24.02 3.37,21.9 U13.2 1.7,20.24 R38.2
EL_8N
  Top 0.152: 3.35,29.41 R41.2 3.47,28.83 U14.2 3.09,26.03 J2.2
EL_8P
  Top 0.152: J2.4 3.74,25.1 3.99,25.1 5.37,26.48 U15.2 7.06,26.48 R44.2
GND  (via drill 0.3 layers 1-2, 0.35)
  Top 0.152: 19.66,11.67 U1.P$31 19.68,10.89 20.09,10.48 v20.89,10.48 20.93,10.48 20.93,10.2 C22.2 | 19.34,21.62 19.91,21.62 20.18,21.89 U1.P$49 | C17.2 C19.2 v23.62,21.59 | U1.P$51 19.18,21.78 19.34,21.62 | C4.2 v15.24,24.64 | 19.34,21.62 v19.2,21.48 | U1.P$41 v20.74,17.44 | 29.72,19.7 C10.2 v29.97,20.32 | C61.2 v28.7,19.3 | C9.2 v30.23,21.34 | C21.2 29.46,29.46 v29.46,28.7 29.46,27.94 | 29.46,27.94 C20.2 | C18.2 29.46,26.42 v29.46,27.18 29.46,27.94 | C62.2 19.2,26.01 v19.05,26.16 | J10.7 21.84,30.57 | J10.8 22.61,30.61 | U21.2 v23.62,26.92 | U1.P$33 21.93,12.94 v21.95,12.93 | J5.39 25.09,13.82 v25.07,13.84 | C66.2 v13.46,7.62 | C65.2 v12.19,7.62 | 3.74,26.35 J2.10 4.04,26.42 v4.32,26.42 | C6.2 7.66,3.05 v7.11,3.05 | J1.10 1.84,9.53 v1.96,9.41 | U3.1 v5.59,7.52 | 5.8,13.72 C8.2 4.55,13.99 v4.32,14.22 | C36.2 6.68,19.05 v7.44,18.29 7.44,18.27 C14.2 | U12.1 5.71,23.5 v4.83,22.61 | C34.2 4.93,22.71 v4.83,22.61 | U13.1 4.83,22.36 v4.83,22.61 | U15.1 5.38,27.69 v4.57,27.69 5.17,28.28 C40.2 | J2.9 1.56,26.12 v1.27,26.42 | J2.11 1.31,23.66 v1.27,23.62 | J2.12 4.28,23.66 v4.32,23.62 | U14.1 1.78,28.45 v1.27,28.96 1.27,29.7 C38.2 | U6.1 2.89,14.22 v4.32,14.22 | U4.1 5.65,12.89 v4.32,14.22 | v2.54,8.13 2.8,7.87 U18.1 | J1.11 3.34,12.41 v3.3,12.45 | J1.12 v1.84,13.47 v1.85,13.48 | J1.9 3.96,9.73 v4.42,9.73 | v5.32,3.16 4.27,3.16 C56.2 | PS1.4 30.48,22.91 v30.48,22.35
  Route2 0.152: v3.3,12.45 2.85,12.45 2.78,12.37 2.3,12.37 2.23,12.45 1.78,12.45
  Bottom 0.152: J5.39 25.07,13.17 v25.07,13.84 | C16.2 7.41,18.29 v7.44,18.29 7.38,18.29 C28.2 | C26.2 6.03,22.61 v4.83,22.61 | U8.1 5.69,23.47 v4.83,22.61 | U9.1 4.83,22.39 v4.83,22.61 | U11.1 4.73,27.53 v4.57,27.69 | U10.1 3.81,28.45 v4.57,27.69 | C32.2 5.14,28.25 v4.57,27.69 | C30.2 1.22,29.01 v1.27,28.96 | U7.1 3.71,14.83 v4.32,14.22 4.45,14.09 U5.1 | 9.53,9.45 v8.81,8.74 | C12.2 8.55,11.98 9.12,11.98 9.39,11.71 9.39,10.76 9.53,10.63 9.53,9.45 | U17.1 2.25,7.84 v2.54,8.13 | 9.53,9.45 10.02,9.95 C2.2 | v4.42,9.73 4.67,9.73 U2.1 | C54.2 4.47,3.16 v5.32,3.16
  other vias: 24.23,30.18
  pour Route2 (no thermals): 0.53,33.78 31.75,33.78 31.75,0.25 0.53,0.25
  pour Bottom (no thermals): 21.59,32 23.62,32 23.62,30.99 23.88,30.73 23.98,30.63 24.1,30.63 24.46,30.63 24.64,30.45 24.64,29.9 24.46,29.72 24.03,29.72 23.6,29.29 23.6,28.42 23.6,27.66 23.55,27.61 21.59,27.61
  pour Top (no thermals): 21.59,32.77 23.62,32.77 23.62,30.99 23.88,30.73 23.98,30.63 24.51,30.63 24.59,30.56 24.66,30.48 24.66,30.38 24.66,29.84 24.64,29.82 24.51,29.69 24.41,29.69 24.05,29.69 24,29.64 23.7,29.34 23.7,29.18 23.62,29.11 23.62,28.42 21.64,28.42 21.59,28.37
IN1N  (via drill 0.3 layers 15-16, 0.35)
  Top 0.152: U1.P$15 11.06,13.81 11.86,13.81 11.87,13.81 v12.41,13.81
  Route15 0.152: v12.41,13.81 12.71,13.5 12.71,6.37 v11.68,5.33
  Bottom 0.152: 3.05,3.01 3.3,3.01 3.82,2.48 8.83,2.48 v11.68,5.33 | 3.05,3.01 C53.2 | R51.1 2.9,2.86 3.05,3.01
IN1P
  Top 0.152: 10.95,13.46 U1.P$16 10.68,13.19 10.68,10.41 11.18,9.91 11.18,4.15 9.48,2.45 4.16,2.45 R54.1 2.82,1.38 C55.2
IN2N  (via drill 0.35)
  Top 0.152: U1.P$13 12.24,14.94 13.34,13.84 v13.34,13.46
  Bottom 0.152: C1.2 11.65,11.3 R1.1 12.06,11.29 12.74,11.98 12.74,12.86 v13.34,13.46
IN2P
  Top 0.152: 8.59,7.25 C5.2 9.49,7 R5.1 10.66,6.99 10.66,8.45 10.36,8.75 10.36,11.46 9.73,12.09 9.73,14.22 9.95,14.44 U1.P$14
IN3N
  Top 0.152: C7.2 8.62,11.42 R9.1 9.42,15.67 9.69,15.94 U1.P$11
IN3P  (via drill 0.35)
  Top 0.152: 10.91,15.42 U1.P$12 12.75,15.44 v12.95,15.24
  Bottom 0.152: R12.1 10.7,13.43 C11.2 11.98,14.2 12.95,15.17 v12.95,15.24
IN4N
  Top 0.152: C13.2 7.66,15.67 R15.1 8.95,16.32 9.58,16.94 U1.P$9
IN4P  (via drill 0.35)
  Top 0.152: v8.38,15.24 9.58,16.44 U1.P$10
  Bottom 0.152: C15.2 7.79,15.75 R18.1 8.28,15.34 v8.38,15.24
IN5N  (via drill 0.35)
  Top 0.152: v8.82,18.98 9.86,17.94 U1.P$7
  Bottom 0.152: R21.1 10.19,23.71 C25.2 10.76,22.7 8.82,20.76 v8.82,18.98
IN5P  (via drill 0.35)
  Top 0.152: U1.P$8 9.48,17.44 v9.4,17.53
  Bottom 0.152: v9.4,17.53 8.2,18.72 R24.1 | R24.1 | R24.1 7.92,20.07 7.59,19.74 7.07,19.74 C27.2
IN6N  (via drill 0.3 layers 15-16, 0.35)
  Top 0.152: U1.P$5 12.34,18.94 v12.7,19.3
  Route15 0.152: v5.08,32 5.88,31.2 5.88,30.5 7.93,28.45 11.18,28.45 12.7,26.92 v12.7,19.3
  Bottom 0.152: R27.1 3.51,32.5 C29.2 4.58,32.5 v5.08,32
IN6P  (via drill 0.35)
  Top 0.152: v13.77,19.28 12.93,18.44 U1.P$6
  Bottom 0.152: v13.77,19.28 13.77,28.14 12.55,29.36 10.41,29.36 | C31.2 10.41,29.36 | R30.1 10.24,29.18 10.41,29.36
IN7N
  Top 0.152: R33.1 10.21,23.71 C33.2 10.76,22.58 9.56,21.38 9.56,20.31 9.86,20.02 | 9.86,20.02 | 9.86,20.02 9.93,19.94 U1.P$3
IN7P
  Top 0.152: 8.04,21.21 R36.1 | U1.P$4 10.89,19.41 9.85,19.41 R36.1 | C35.2 6.69,21.07 R36.1
IN8N
  Top 0.152: R39.1 3.72,33.07 C37.2 10.7,32.48 11.94,31.24 11.94,21.84 11.04,20.94 U1.P$1
IN8P
  Top 0.152: C39.2 10.24,29.58 R42.1 11.63,26.79 11.63,22.1 10.85,21.31 10,21.31 9.86,21.18 9.86,20.57 9.99,20.44 U1.P$2
IO1  (via drill 0.35)
  Top 0.152: J5.2 29.21,3.13 v29.21,2.97
  Bottom 0.152: J5.2 29.21,3.13 v29.21,2.97
IO2  (via drill 0.35)
  Top 0.152: v30.07,3.3 29.72,3.65 29.72,3.9 29.46,4.15 J5.4
  Bottom 0.152: J5.4 28.81,4.03 29.58,4.03 29.72,3.9 29.72,3.65 v30.07,3.3
IO3  (via drill 0.35)
  Top 0.152: J5.6 28.76,4.57 29.91,4.57 30.7,3.78 v30.83,3.78
  Bottom 0.152: J5.6 28.79,4.55 29.94,4.55 30.7,3.78 v30.83,3.78
IO4/SCL1  (via drill 0.35)
  Top 0.152: v30.84,4.64 30.33,4.64 29.85,5.12 28.72,5.12 J5.8
  Bottom 0.152: J5.8 29.84,5.15 30.35,4.64 v30.84,4.64
IO5/SDA1  (via drill 0.35)
  Top 0.152: J5.10 29.5,5.65 29.64,5.51 v30.86,5.51
  Bottom 0.152: J5.10 29.5,5.65 29.64,5.51 v30.86,5.51
IO6  (via drill 0.35)
  Top 0.152: v30,6.11 29.95,6.15 J5.12
  Bottom 0.152: J5.12 29.95,6.15 v30,6.11
IO7  (via drill 0.35)
  Top 0.152: J5.14 28.71,6.67 29.69,6.67 29.71,6.69 30.53,6.69 v30.82,6.39
  Bottom 0.152: J5.14 29.67,6.65 29.71,6.69 30.53,6.69 v30.82,6.39
IO8  (via drill 0.35)
  Top 0.152: v30.02,7.27 29.9,7.15 J5.16
  Bottom 0.152: J5.16 29.9,7.15 v30.02,7.27
IO9  (via drill 0.35)
  Top 0.152: v26.92,8.22 27.53,7.62 28.66,7.62 J5.18
  Bottom 0.152: J5.18 27.5,7.65 v26.92,8.22
IO10  (via drill 0.35)
  Top 0.152: v30.91,7.37 30.12,8.15 J5.20
  Bottom 0.152: J5.20 30.12,8.15 v30.91,7.37
IO11  (via drill 0.35)
  Top 0.152: v30.86,8.33 30.54,8.65 J5.22
  Bottom 0.152: J5.22 30.54,8.65 v30.86,8.33
IO12  (via drill 0.35)
  Top 0.152: J5.24 v27.18,9.15 v27.18,9.14
  Bottom 0.152: J5.24 v27.18,9.14
IO13  (via drill 0.35)
  Top 0.152: v29.99,9.23 29.57,9.65 J5.26
  Bottom 0.152: J5.26 29.57,9.65 v29.99,9.23
IO14  (via drill 0.35)
  Top 0.152: v30.85,9.19 30.57,9.47 29.9,10.15 J5.28
  Bottom 0.152: v30.85,9.19 30.57,9.47 29.9,10.15 J5.28
IO15  (via drill 0.35)
  Top 0.152: v30.82,10.05 30.22,10.65 J5.30
  Bottom 0.152: J5.30 30.22,10.65 v30.82,10.05
IO16  (via drill 0.35)
  Top 0.152: J5.32 30.54,11.15 v30.62,11.07
  Bottom 0.152: J5.32 30.54,11.15 v30.62,11.07
IO17  (via drill 0.35)
  Top 0.152: v27.18,11.68 28.65,11.68 J5.34
  Bottom 0.152: J5.34 27.21,11.65 v27.18,11.68
IO18  (via drill 0.35)
  Top 0.152: J5.36 30.01,12.15 v30.23,11.94
  Bottom 0.152: J5.36 30.01,12.15 v30.23,11.94
N$1
  Bottom 0.152: C1.1 8.55,11.3 R2.1 C2.1
N$2
  Bottom 0.152: R2.2 6.23,10.3 R3.1
N$3
  Top 0.152: R6.1 7.85,5.7 8.38,5.7 | 8.38,5.7 C5.1 | C6.1 9.03,5.05 8.38,5.7
N$4
  Top 0.152: R8.1 6.91,5.81 R6.2
N$5
  Top 0.152: C8.1 6.93,13.55 R10.1 7.39,12.23 C7.1
N$6
  Top 0.152: R10.2 6.93,10.47 R11.1
N$7
  Bottom 0.152: R13.1 9.16,13.69 C12.1 9.16,13.19 C11.1
N$8
  Bottom 0.152: R14.1 6.44,13.04 R13.2
N$9
  Top 0.152: C13.1 5.34,15.72 C14.1 5.29,17.53 R16.1
N$10
  Top 0.152: R17.1 2.49,17.47 R16.2
N$11
  Bottom 0.152: C15.1 C16.1 5.34,17.53 R19.1
N$12
  Bottom 0.152: R19.2 1.58,16.46 R20.1
N$13
  Bottom 0.152: C26.1 7.86,23.14 C25.1 9.46,24.72 R22.1
N$14
  Bottom 0.152: R22.2 8.13,24.09 R23.1
N$15
  Bottom 0.152: R25.1 5.22,19.15 | 5.22,19.15 C28.1 | C27.1 4.86,19.51 5.22,19.15
N$16
  Bottom 0.152: R26.1 2.44,19.29 R25.2
N$17
  Top 0.152: 26.21,23.18 C3.1 26.56,23.48 27.18,22.86 27.89,22.86 PS1.3
N$18
  Top 0.152: C3.2 25.91,25.93 27.07,27.09 27.99,27.09 28.12,26.96 28.12,26.01 29.31,24.83 PS1.6
N$19
  Bottom 0.152: C30.1 2.39,31.31 R28.1 3.85,31.67 C29.1
N$20
  Top 0.152: U21.4 24.44,25.36 24.94,25.36 25.4,25.82 25.4,26.16 27.18,27.94 C20.1
N$21
  Bottom 0.152: R29.1 3.47,29.94 R28.2
N$22
  Bottom 0.152: C32.1 7.77,28.85 8.28,29.36 C31.1 8.98,28.59 9.21,28.35 9.21,27.54 R31.1
N$23
  Bottom 0.152: R31.2 8.13,27.45 R32.1
N$24
  Top 0.152: C34.1 7.86,23.16 9.4,23.16 | 9.4,23.16 C33.1 | R34.1 9.4,24.78 9.4,23.16
N$25
  Top 0.152: R34.2 8.15,24.06 R35.1
N$26
  Top 0.152: C36.1 5.01,19.25 | R37.1 5.12,19.15 C36.1 | C35.1 5.22,20.5 C36.1
N$27
  Top 0.152: 2.52,19.24 R37.2 1.3,19.15 R38.1
N$28
  Top 0.152: C37.1 4.08,31.41 3,31.41 R40.1 2.57,31.5 1.15,31.5 C38.1
N$29
  Top 0.152: R40.2 2.68,30.6 2.47,30.39 R41.1
N$30
  Top 0.152: C39.1 8.86,29.5 8.86,29.24 8.64,29.02 R43.1 | R43.1 | C40.1 7.72,28.85 R43.1
N$31
  Top 0.152: R44.1 8.14,27.42 R43.2
N$36
  Bottom 0.152: C53.1 2.97,4.36 C54.1 5.02,5.01 R52.1
N$37
  Bottom 0.152: R52.2 R53.1
N$38
  Top 0.152: R58.1 2.15,4.49 C55.1 C56.1
N$39
  Top 0.152: R58.2 2.83,6.14 R59.1
RLDOUT  (via drill 0.3 layers 15-16, 0.35)
  Top 0.152: 14.22,22.74 U1.P$61 | v1.5,32.21 2.19,32.9 R39.2 | R42.2 v9.41,26.36 | v9.41,26.36 | R36.2 7.57,20.07 v7.3,20.34 | v7.45,16.75 8.02,17.32 R15.2 | R5.2 10.08,8.21 v9.84,8.45 9.42,8.87 R9.2 | R54.2 3.98,1.27 v4.83,1.27 | 14.18,21.34 14.23,21.34 v14.35,21.23 | R33.2 v9.41,26.36
  Top 0.203: 13.15,21.59 13.18,21.62 13.46,21.34 14.18,21.34
  Top 0.254: 14.18,21.34 U1.P$61 | U1.P$63 13.18,21.62
  Route15 0.152: v7.45,16.75 8.37,15.82 8.62,15.82 11.67,12.77 v11.67,12.02 10.88,11.23 v10.88,10.29 10.86,10.27 10.86,9.46 v9.84,8.45 9.84,6.29 v4.83,1.27 | v7.45,16.75 6.79,17.41 6.79,18.53 7.3,19.04 v7.3,20.34 9.41,22.46 v9.41,26.36 9.41,26.54 3.74,32.21 v1.5,32.21 | v7.45,16.75 12.06,16.75 14.35,19.04 v14.35,21.23
  Bottom 0.152: R27.2 1.5,32.63 v1.5,32.21 | R30.2 9.97,26.67 9.63,26.67 9.63,26.36 | R24.2 7.48,20.34 v7.3,20.34 | R18.2 7.94,17.24 v7.45,16.75 | R1.2 v10.88,10.29 | R12.2 11.7,12.05 v11.67,12.02 | R51.2 4.7,1.4 v4.83,1.27 | R21.2 9.63,26.13 9.63,26.36 | 9.63,26.36 9.62,26.36 v9.41,26.36
RXD0/SDA0  (via drill 0.35)
  Top 0.152: J5.29 26.12,10.65 26.18,10.6 27.11,10.6 v27.18,10.67
  Bottom 0.152: J5.29 26.12,10.65 26.18,10.6 27.11,10.6 v27.18,10.67
SCLK  (via drill 0.35)
  Top 0.152: U1.P$40 21.12,16.94 20.87,16.68 v20.55,16.68 | v26.42,11.18 26.39,11.15 J5.31
  Route15 0.152: v20.55,16.68 25.8,11.43 26.16,11.43 v26.42,11.18
  Bottom 0.152: J5.31 25.11,11.18 v26.42,11.18
TXD0/SCL0  (via drill 0.35)
  Top 0.152: J5.27 26.28,10.15 v26.42,10.01
  Bottom 0.152: J5.27 26.28,10.15 v26.42,10.01
USB_D+/D8  (via drill 0.35)
  Top 0.152: J5.17 26.59,7.65 v26.95,7.29
  Bottom 0.152: J5.17 26.59,7.65 v26.95,7.29
USB_D-/D7  (via drill 0.35)
  Top 0.152: J5.15 26.25,7.15 v26.97,6.43
  Bottom 0.152: J5.15 26.25,7.15 v26.97,6.43
V+  (via drill 0.35)
  Top 0.152: C65.1 C66.1 13.68,10.01 U1.P$19 13.68,12.49 13.99,12.8 14.68,12.8 | U1.P$22 15.18,12.7 15.08,12.8 14.68,12.8 | 14.68,12.8 U1.P$21 | 14.68,12.8 15.7,13.82 19.56,13.82 | U1.P$32 20.18,12.59 19.56,13.21 19.56,13.82 | U1.P$60 14.68,21.72 14.77,21.62 15.17,21.62 15.18,21.63 | U1.P$59 15.18,21.63 | 24.35,23.37 U21.5 | 19.56,13.82 19.56,19.3 17.68,21.18 v17.68,21.34 U1.P$54 17.68,21.72 17.59,21.62 16.71,21.62 16.68,21.59 | U21.5 25.11,24.13 27.71,24.13 PS1.2 PS1.5 | U21.5 24.57,22.56 C19.1 C17.1 | v23.62,23.37 23.85,23.59 U21.5 | 15.18,21.63 15.32,21.5 15.32,21.02 15.61,20.73 16.41,20.73 16.68,21 16.68,21.59 | U1.P$56 16.68,21.59
  Route15 0.152: v17.68,21.34 19.71,23.37 v23.62,23.37
V-  (via drill 0.35)
  Top 0.152: U1.P$20 14.18,10.71 14.27,10.62 15.6,10.62 15.68,10.7 U1.P$23 15.68,12.63 15.82,12.78 16.26,12.78 | 16.26,12.78 16.54,12.78 16.68,12.63 U1.P$25 16.68,10.24 16.68,8.64 | 16.68,8.64 16.68,8.58 16.6,8.49 C24.2 C23.2 | C4.1 14.37,25.94 C64.2 C63.2 C60.2 16.18,24.45 16.18,24.05 | 16.18,24.05 U1.P$57 16.18,21.54 v15.95,21.31 | U1.P$58 15.68,23.55 16.18,24.05 | C18.1 27.04,25.91 26.64,25.91 v26.68,25.88 27.73,24.83 PS1.1 | 16.26,12.78 16.26,13.19 v16.21,13.24 | 16.68,8.64 16.82,8.49 C57.2 C58.2 C59.2 C22.1 | v19.3,20.73 19.03,21 19,21 18.18,21.82 U1.P$53
  Route15 0.152: v26.68,25.88 26.68,24.39 24.64,22.35 21.34,22.35 20.07,21.08 19.66,21.08 v19.3,20.73 19.15,20.57 16.69,20.57 v15.95,21.31 16.21,21.06 v16.21,13.24
VCAP1
  Top 0.152: C58.1 18.18,10.41 U1.P$28
VCAP2
  Top 0.152: C59.1 19.18,10.68 U1.P$30
VCAP3
  Top 0.152: U1.P$55 17.18,24.15 C60.1 C63.1
VCAP4
  Top 0.152: C57.1 17.18,10.14 U1.P$26
VREFP
  Top 0.152: U1.P$24 16.18,10.87 16,10.69 C24.1 C23.1
WCT
  Top 0.152: U1.P$64 12.68,23.9 12.49,24.09 12.49,25.58 C64.1
~CS
  Top 0.152: S1.4 S1.3 S1.2 S1.1 15.34,6.6 21,6.6 22.02,7.62 22.02,11.3 19.89,13.43 19.89,15.2 21.12,16.44 U1.P$39 21.95,16.42 22.91,16.42 R4.2
~PWDN
  Top 0.152: U1.P$35 23.77,14.45 25.83,16.51 27.18,16.51 27.43,16.76 R56.2
~RESET
  Top 0.152: U1.P$36 23.84,14.95 25.65,16.76 R55.2
(copper drawn outside any net)
  shapes: Top area x2

### Text on the board
bNames: EMG Board - Rev. B | (c) 2022 e-Nable Italia / Alberto Navatta <alberto@e-nableitalia.it> / This schematic is licensed with a Creative Common Attribution- / NonCommercial-ShareAlike 4.0 International License
_tPlace: U18
_bPlace: U17
_tNames: R39 | C37 | R40 | R41 | C39 | C38 | C40 | R42 | C21 | R44 | R43 | C20 | C64 | C63 | C62 | J10 | C60 | C3 | C18 | R35 | C4 | R34 | R33 | R7 | U20 | C34 | U21 | J2 | C33 | C19 | C9 | R36 | C17 | R37 | C35 | R56 | C10 | R38 | C36 | R4 | R55 | C14 | R16 | C61 | R17 | C13 | R15 | C8 | R10 | R11 | C7 | R9 | J1 | R8 | R5 | C65 | C66 | C23 | C24 | C57 | C58 | C59 | R58 | C5 | C22 | C55 | C56 | R59 | R6 | C6 | S1 | J7 | R54
_bNames: R27 | R28 | C29 | C30 | C32 | C31 | R29 | R32 | R31 | R30 | R22 | J9 | R23 | R21 | C25 | C26 | C27 | C28 | R24 | R26 | R25 | R20 | R19 | C16 | R18 | C15 | C11 | R14 | C12 | R13 | R1 | R12 | R3 | C1 | R2 | C2 | R52 | R53 | C53 | C54 | J5 | R51
_tValues: U15 | U14 | U13 | U12 | U4 | U6 | U18 | U3
_bValues: U11 | U10 | U8 | U9 | U5 | U7 | U2 | U17